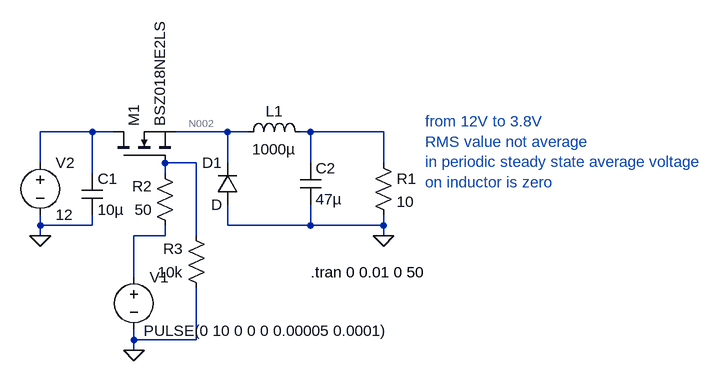
[diagram p0: schematic lecture_5_buck_converter.asc]
lecture_5_buck_converter.asc, the LTspice schematic file:
Version 4
SHEET 1 1040 680
WIRE -208 80 -288 80
WIRE -176 80 -208 80
WIRE 0 80 -80 80
WIRE 32 80 0 80
WIRE 128 80 112 80
WIRE 240 80 128 80
WIRE -288 128 -288 80
WIRE -48 128 -96 128
WIRE 0 128 0 80
WIRE 128 128 128 80
WIRE 240 128 240 80
WIRE -208 144 -208 80
WIRE -96 144 -96 128
WIRE -288 224 -288 208
WIRE -208 224 -208 208
WIRE -208 224 -288 224
WIRE 0 224 0 192
WIRE 128 224 128 192
WIRE 128 224 0 224
WIRE 240 224 240 208
WIRE 240 224 128 224
WIRE -288 240 -288 224
WIRE -96 240 -96 224
WIRE -96 240 -144 240
WIRE -48 240 -48 128
WIRE 240 240 240 224
WIRE -144 304 -144 240
WIRE -144 400 -144 384
WIRE -48 400 -48 320
WIRE -48 400 -144 400
WIRE -144 416 -144 400
FLAG -288 240 0
FLAG 240 240 0
FLAG -144 416 0
SYMBOL voltage -144 288 R0
WINDOW 3 15 98 Left 2
WINDOW 123 24 124 Left 2
WINDOW 39 0 0 Left 0
SYMATTR Value PULSE(0 10 0 0 0 0.00005 0.0001)
SYMATTR InstName V1
SYMBOL ind 16 96 R270
WINDOW 0 32 56 VTop 2
WINDOW 3 5 56 VBottom 2
SYMATTR InstName L1
SYMATTR Value 1000µ
SYMBOL res 224 112 R0
SYMATTR InstName R1
SYMATTR Value 10
SYMBOL cap -224 144 R0
SYMATTR InstName C1
SYMATTR Value 10µ
SYMBOL cap 112 128 R0
SYMATTR InstName C2
SYMATTR Value 47µ
SYMBOL nmos -176 128 R270
SYMATTR InstName M1
SYMATTR Value BSZ018NE2LS
SYMBOL res -80 240 R180
WINDOW 0 36 76 Left 2
WINDOW 3 36 40 Left 2
SYMATTR InstName R2
SYMATTR Value 50
SYMBOL res -32 336 R180
WINDOW 0 36 76 Left 2
WINDOW 3 36 40 Left 2
SYMATTR InstName R3
SYMATTR Value 10k
SYMBOL voltage -288 112 R0
WINDOW 123 0 0 Left 0
WINDOW 39 0 0 Left 0
SYMATTR InstName V2
SYMATTR Value 12
SYMBOL diode 16 192 R180
WINDOW 0 24 64 Left 2
WINDOW 3 24 0 Left 2
SYMATTR InstName D1
TEXT 128 296 Left 2 !.tran 0 0.01 0 50
TEXT 304 64 Left 2 ;from 12V to 3.8V\nRMS value not average\nin periodic steady state average voltage\non inductor is zero

The netlist it stands for:
* lecture_5_buck_converter.asc
V1 N005 0 PULSE(0 10 0 0 0 0.00005 0.0001)
L1 N002 N003 1000µ
R1 N003 0 10
C1 N001 0 10µ
C2 N003 0 47µ
M1 N001 N004 N002 N002 BSZ018NE2LS
R2 N005 N004 50
R3 0 N004 10k
V2 N001 0 12
D1 0 N002 D
.model D D
.lib standard.dio
.model NMOS NMOS
.model PMOS PMOS
.lib standard.mos
.tran 0 0.01 0 50
* from 12V to 3.8V
* RMS value not average
* in periodic steady state average voltage
* on inductor is zero
.backanno
.end

* Results of the author's LTspice run, read from the files saved beside the schematic
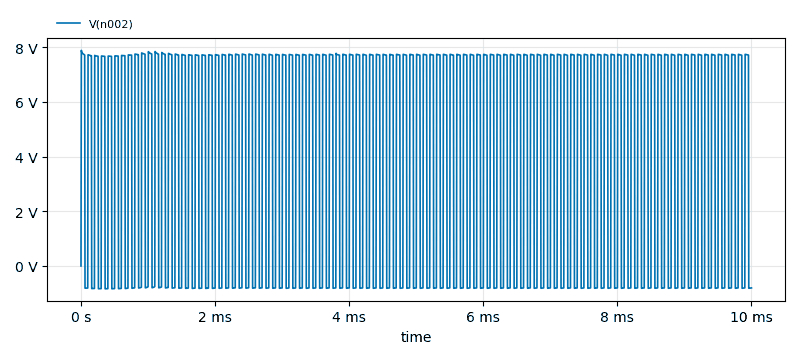
[diagram p1: Transient Analysis of lecture_5_buck_converter.asc, plotted from the saved traces]
* Transient Analysis, 1 run:
*   V(n002): min -834.3 mV, max 7.884 V, average 3.825 V, rms 5.629 V, last -801.7 mV